# EasyEDA schematic SCH_ESP32-S3-WROOM-RadioGateway-v1.0_2026-06-17.json
TITLE: ESP32-S3-WROOM - RadioGateway v1.0; REV: 1.0; Date: 2026-06-16; Sheet: 1/1; Drawn By: sa7bnb; Company: SA7BNB
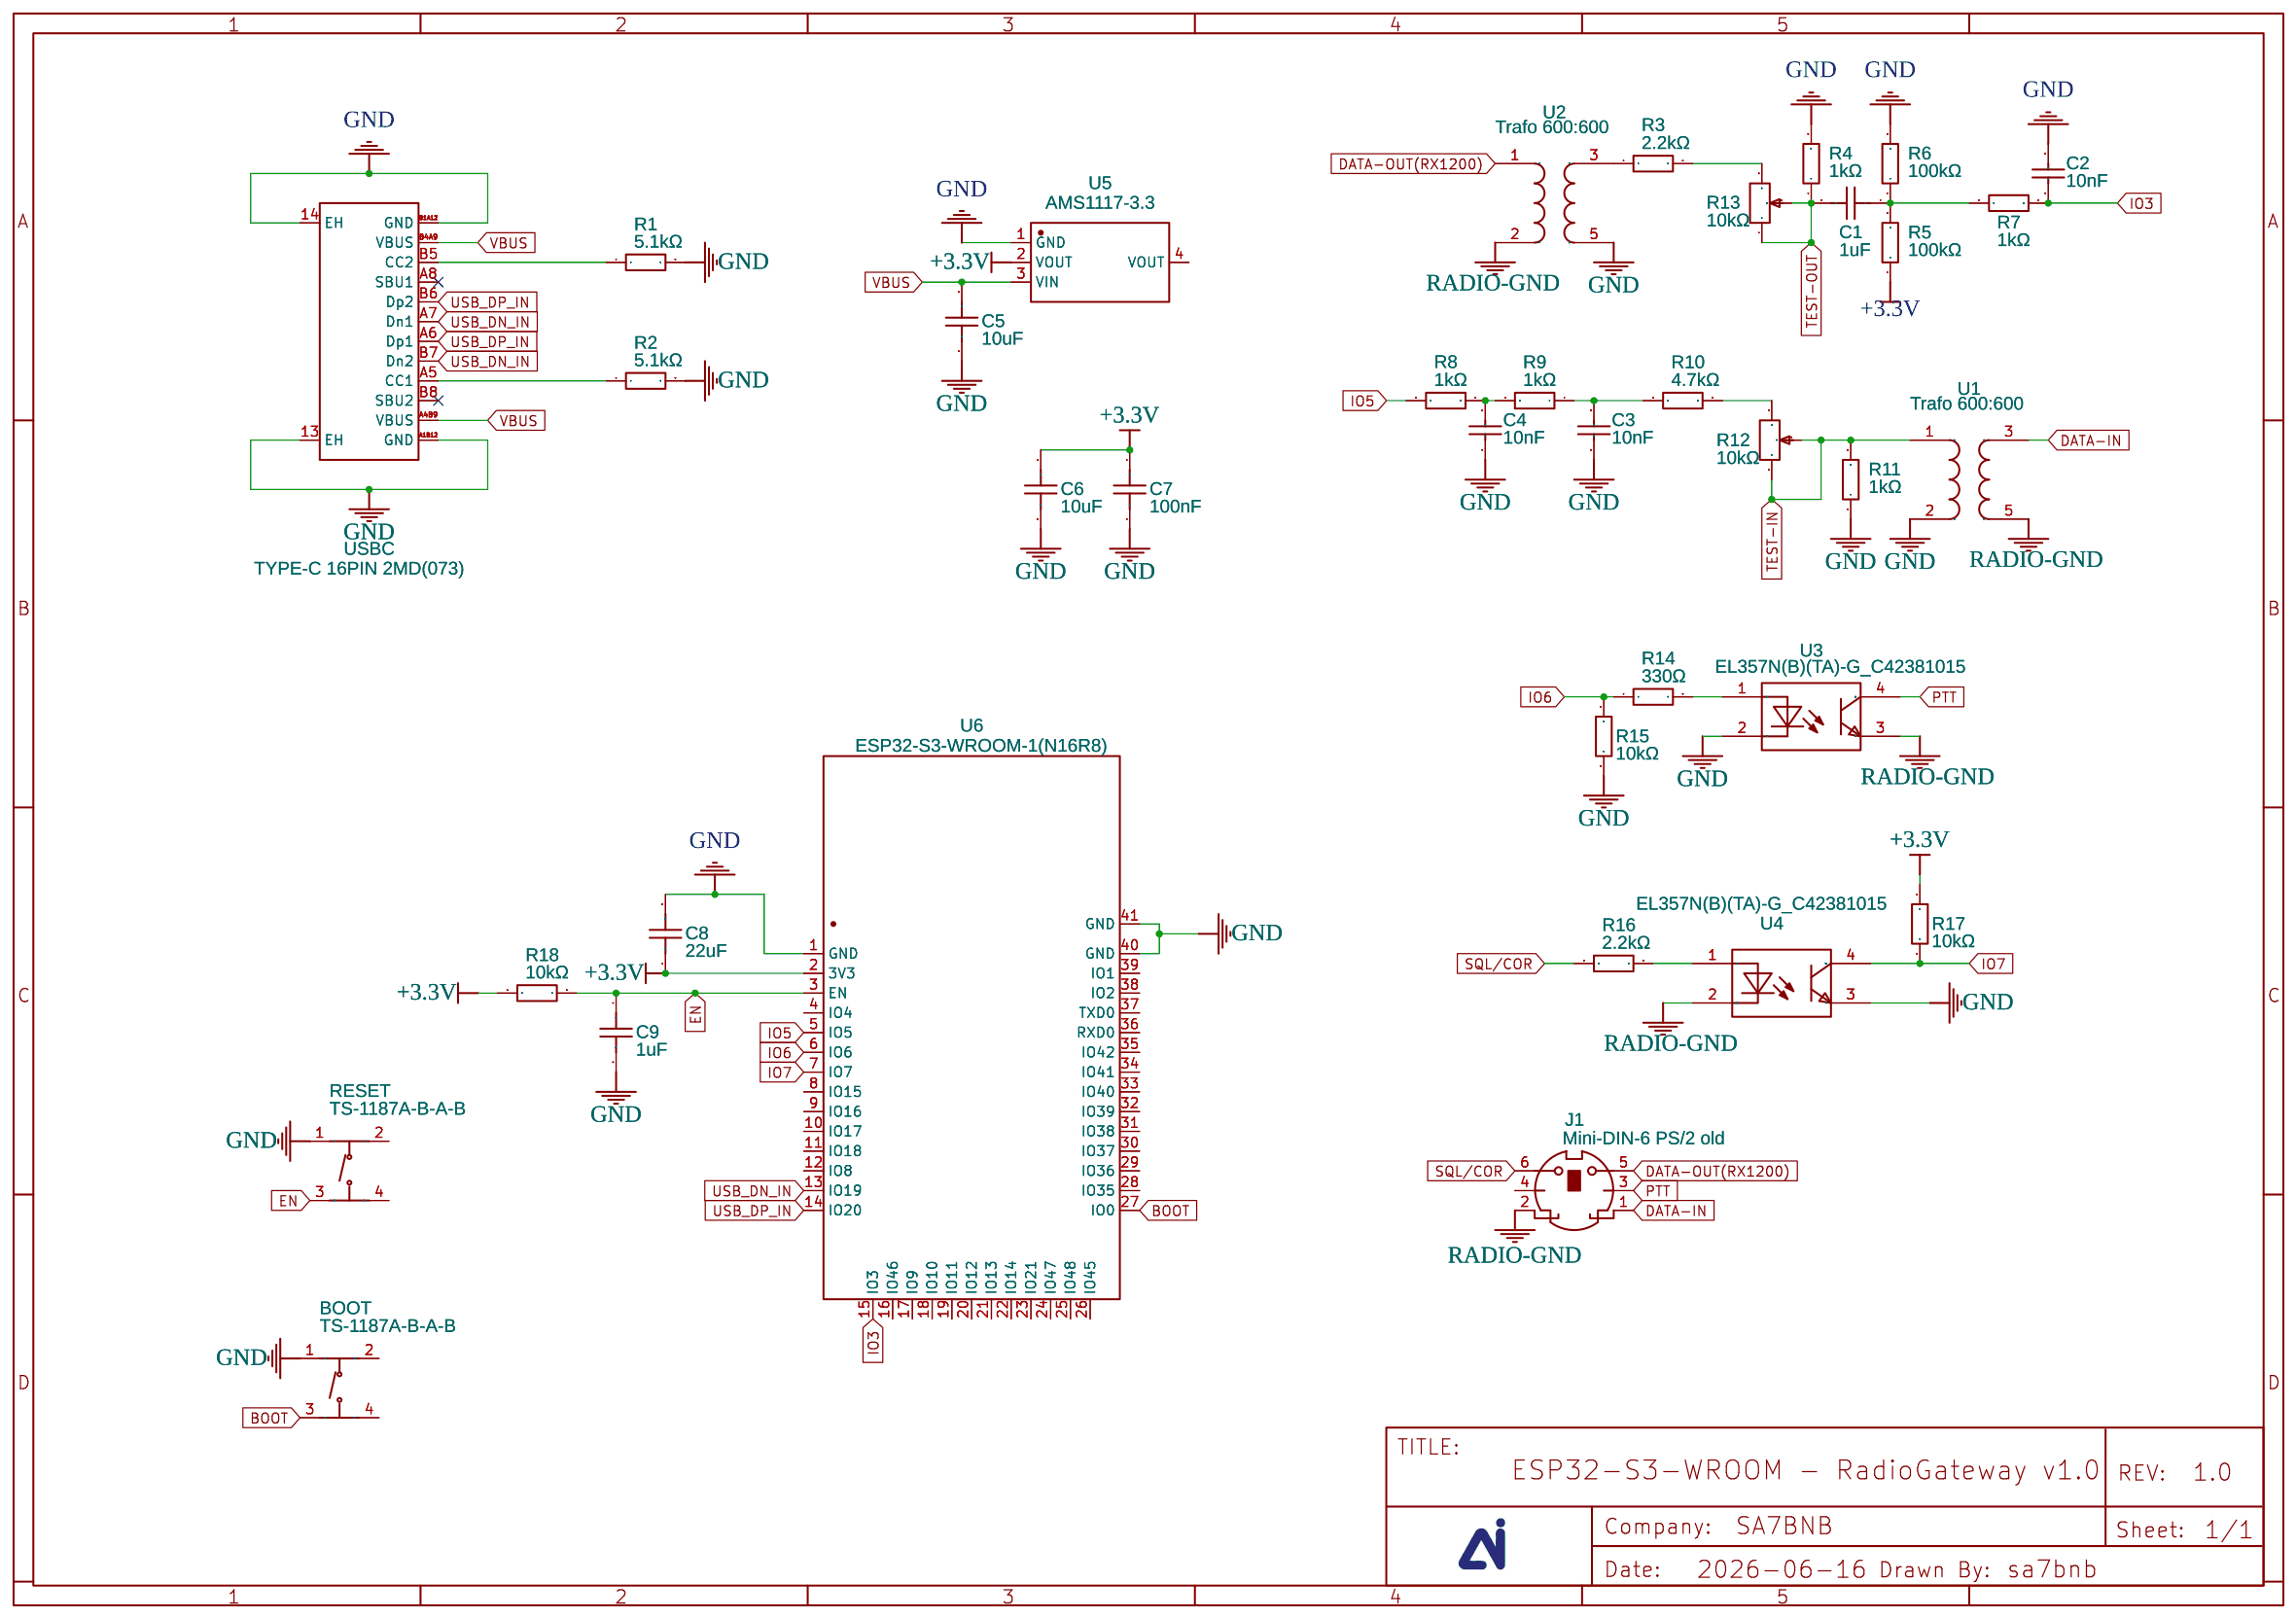
[diagram p0: schematic sheet]

## Parts
BOOT  TS-1187A-B-A-B  [SW-SMD_4P-L5.1-W5.1-P3.70-LS6.5-TL_H1.5]
C1  1uF  [C0402]
C2  10nF  [C0402]
C3  10nF  [C0402]
C4  10nF  [C0402]
C5  10uF  [C0603]
C6  10uF  [C0603]
C7  100nF  [C0402]
C8  22uF  [C0805]
C9  1uF  [C0402]
J1  Mini-DIN-6 PS/2 old  [MINI-DIN6]
R1  5.1kΩ  [R0402]
R2  5.1kΩ  [R0402]
R3  2.2kΩ  [R0402]
R4  1kΩ  [R0402]
R5  100kΩ  [R0402]
R6  100kΩ  [R0402]
R7  1kΩ  [R0402]
R8  1kΩ  [R0402]
R9  1kΩ  [R0402]
R10  4.7kΩ  [R0402]
R11  1kΩ  [R0402]
R12  10kΩ  [RES-ADJ-TH_3296W]
R13  10kΩ  [RES-ADJ-TH_3296W]
R14  330Ω  [R0402]
R15  10kΩ  [R0402]
R16  2.2kΩ  [R0402]
R17  10kΩ  [R0402]
R18  10kΩ  [R0402]
RESET  TS-1187A-B-A-B  [SW-SMD_4P-L5.1-W5.1-P3.70-LS6.5-TL_H1.5]
U1  Trafo 600:600  [TRANSFORMER_600:600_ALIEXPRESS]
U2  Trafo 600:600  [TRANSFORMER_600:600_ALIEXPRESS]
U3  EL357N(B)(TA)-G_C42381015  [OPTO-SMD-4_L4.4-W4.1-P2.54-LS7.0-TL]
U4  EL357N(B)(TA)-G_C42381015  [OPTO-SMD-4_L4.4-W4.1-P2.54-LS7.0-TL]
U5  AMS1117-3.3  [SOT-223-3_L6.5-W3.4-P2.30-LS7.0-BR]
U6  ESP32-S3-WROOM-1(N16R8)  [WIRELM-SMD_ESP32-S3-WROOM-1]
USBC  TYPE-C 16PIN 2MD(073)  [USB-C-SMD_TYPE-C-16PIN-2MD-073]

## Library data of the parts
BOOT RESET = TS-1187A-B-A-B: Contributor: LCSC; Supplier: LCSC; Supplier Part: C318884; Manufacturer: XKB Connection(中国星坤); JLCPCB Part Class: Basic Part
C1 C9 = CL05A105KA5NQNC: Supplier: LCSC; Manufacturer: SAMSUNG(三星); Supplier Part: C52923; JLCPCB Part Class: Basic Part
C2-C4 = CL05B103KB5NNNC: Supplier: LCSC; Manufacturer: SAMSUNG(三星); Supplier Part: C15195; JLCPCB Part Class: Basic Part
C5 C6 = CL10A106KP8NNNC: Supplier: LCSC; Manufacturer: SAMSUNG(三星); Supplier Part: C19702; JLCPCB Part Class: Basic Part
C7 = CL05B104KO5NNNC: Supplier: LCSC; Manufacturer: SAMSUNG(三星); Supplier Part: C1525; JLCPCB Part Class: Basic Part
C8 = CL21A226MAQNNNE: Supplier: LCSC; Manufacturer: SAMSUNG(三星); Supplier Part: C45783; JLCPCB Part Class: Basic Part
J1 = Mini-DIN-6 PS/2 old: Contributor: tcollings
R1 R2 = 0402WGF5101TCE: Supplier: LCSC; Manufacturer: UNI-ROYAL(厚声); Supplier Part: C25905; JLCPCB Part Class: Basic Part
R3 R16 = 0402WGF2201TCE: Supplier: LCSC; Manufacturer: UNI-ROYAL(厚声); Supplier Part: C25879; JLCPCB Part Class: Basic Part
R4 R7-R9 R11 = 0402WGF1001TCE: Supplier: LCSC; Manufacturer: UNI-ROYAL(厚声); Supplier Part: C11702; JLCPCB Part Class: Basic Part
R5 R6 = 0402WGF1003TCE: Supplier: LCSC; Manufacturer: UNI-ROYAL(厚声); Supplier Part: C25741; JLCPCB Part Class: Basic Part
R10 = 0402WGF4701TCE: Supplier: LCSC; Manufacturer: UNI-ROYAL(厚声); Supplier Part: C25900; JLCPCB Part Class: Basic Part
R12 R13 = 3296W-1-103LF: Resistance(Ohms): 10K; Supplier: LCSC; Manufacturer: BOURNS; Supplier Part: C34846; JLCPCB Part Class: Extended Part
R14 = 0402WGF3300TCE: Supplier: LCSC; Manufacturer: UNI-ROYAL(厚声); Supplier Part: C25104; JLCPCB Part Class: Basic Part
R15 R17 R18 = 0402WGF1002TCE: Supplier: LCSC; Manufacturer: UNI-ROYAL(厚声); Supplier Part: C25744; JLCPCB Part Class: Basic Part
U1 U2 = eduardo: Manufacturer: YongYeTai; Supplier: Aliexpress; link: https://www.aliexpress.com/item/4000029222348.html; Contributor: Eduardo_Nogueira
U3 U4 = EL357N(B)(TA)-G_C42381015: Supplier: LCSC; Supplier Part: C42381015; Manufacturer: EVERLIGHT(亿光); Manufacturer Part: EL357N(B)(TA)-G; Contributor: lcsc; JLCPCB Part Class: Extended Part
U5 = AMS1117-3.3: sourceId: dwIGgezVh; Supplier: LCSC; Manufacturer: Advanced Monolithic Systems; Supplier Part: C6186; JLCPCB Part Class: Basic Part
U6 = ESP32-S3-WROOM-1(N16R8): Contributor: lcsc; Supplier: LCSC; Supplier Part: C2913202; Manufacturer: ESPRESSIF(乐鑫); Manufacturer Part: ESP32-S3-WROOM-1-N16R8; JLCPCB Part Class: Extended Part
USBC = TYPE-C 16PIN 2MD(073): Contributor: LCSC; Supplier: LCSC; Supplier Part: C2765186; Manufacturer: SHOU HAN(首韩); JLCPCB Part Class: Extended Part

## Nets
+3.3V: C6.1 C7.1 C8.1 R5.1 R17.1 R18.1 U5.2(VOUT) U6.2(3V3)
GND: BOOT.1(A) C2.2 C3.1 C4.1 C5.1 C6.2 C7.2 C8.2 C9.2 R1.2 R2.2 R4.2 R6.2 R11.1 R15.2 RESET.1(A) U1.2 U2.5 U3.2(CAT) U4.3(EM) U5.1(GND) U6.1(GND) U6.40(GND) U6.41(GND) USBC.13(EH) USBC.14(EH) USBC.A1B12(GND) USBC.B1A12(GND)
VBUS: C5.2 U5.3(VIN) USBC.A4B9(VBUS) USBC.B4A9(VBUS)
BOOT: BOOT.3(C) U6.27(IO0)
DATA-IN: J1.1 U1.3
DATA-OUT(RX1200): J1.5 U2.1
EN: C9.1 R18.2 RESET.3(C) U6.3(EN)
IO3: C2.1 R7.2 U6.15(IO3)
IO5: R8.2 U6.5(IO5)
IO6: R14.1 R15.1 U6.6(IO6)
IO7: R17.2 U4.4(COL) U6.7(IO7)
PTT: J1.3 U3.4(COL)
RADIO-GND: J1.2 U1.5 U2.2 U3.3(EM) U4.2(CAT)
SQL/COR: J1.6 R16.1
TEST-IN: R11.2 R12.1 R12.2 U1.1
TEST-OUT: C1.2 R4.1 R13.1 R13.2
USB_DN_IN: U6.13(IO19) USBC.A7(Dn1) USBC.B7(Dn2)
USB_DP_IN: U6.14(IO20) USBC.A6(Dp1) USBC.B6(Dp2)
Net-(C1-1): C1.1 R5.2 R6.1 R7.1
Net-(C3-2): C3.2 R9.1 R10.1
Net-(C4-2): C4.2 R8.1 R9.2
Net-(R1-1): R1.1 USBC.B5(CC2)
Net-(R2-1): R2.1 USBC.A5(CC1)
Net-(R3-1): R3.1 U2.3
Net-(R3-2): R3.2 R13.3
Net-(R10-2): R10.2 R12.3
Net-(R14-2): R14.2 U3.1(AN)
Net-(R16-2): R16.2 U4.1(AN)

Not connected (* = marked no-connect by the designer): BOOT 2(B) 4(D); J1 4; RESET 2(B) 4(D); U5 4(VOUT); U6 4(IO4) 8(IO15) 9(IO16) 10(IO17) 11(IO18) 12(IO8) 16(IO46) 17(IO9) 18(IO10) 19(IO11) 20(IO12) 21(IO13) 22(IO14) 23(IO21) 24(IO47) 25(IO48) 26(IO45) 28(IO35) 29(IO36) 30(IO37) 31(IO38) 32(IO39) 33(IO40) 34(IO41) 35(IO42) 36(RXD0) 37(TXD0) 38(IO2) 39(IO1); USBC A8(SBU1)* B8(SBU2)*
